# Altium schematic sheet 10_SPI.schdoc.schdoc
size 309 x 223 mm; Symbol: Sheet-Symbol_A4; Device: Sheet-Symbol_A4; @Page Name: SPI; @Create Date: 2023-12-01; @Page Count: 13; @Page No: 13; @Project Name: STM32F722RET6; @Schematic Name: 开发板; @Update Date: 2023-12-01; Company: 嘉立创EDA; Page Size: A4; Version: V1.0
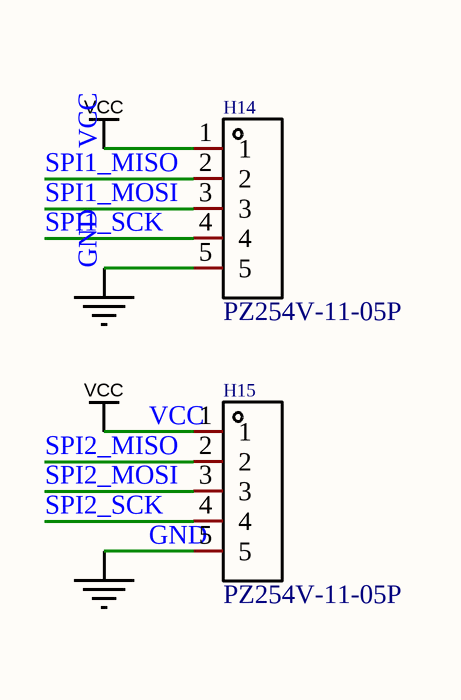
[diagram p0: 10_SPI.schdoc.schdoc]

## Parts
H14  PZ254V-11-05P  [HDR-TH_5P-P2.54-V-M]
H15  PZ254V-11-05P  [HDR-TH_5P-P2.54-V-M]

## Nets
GND: H14.5 H15.5
VCC: H14.1 H15.1
SPI1_MISO: H14.2
SPI1_MOSI: H14.3
SPI1_SCK: H14.4
SPI2_MISO: H15.2
SPI2_MOSI: H15.3
SPI2_SCK: H15.4

## Notes on the sheet
- 1
- 2
- 3
- 4
- 5
- 6
- A
- B
- C
- 原理图
- 开发板
- 创建日期
- 更新日期
- 2023-12-01
- 审阅
- 绘制
- 图页
- SPI
- 物料编码
- STM32F722RET6
- D
- 版本
- 尺寸
- 页
- 13
- 共
- V1.0
- A4
- 嘉立创EDA

## Library data of the parts
H14 H15 = PZ254V-11-05P: 排数:单排;总PIN位数:5P;间距:2.54mm;插针结构:1x5P;行距:-;安装类型:直插;圆针/方针:方针;额定电流:-;额定电压:-;配合针长度:6mm;塑高:2.5mm;端接针长度:3mm;触头材质:黄铜;触头镀层:-;工作温度范围:-40℃~+105℃;颜色:黑色;; Manufacturer: XFCN(兴飞); Add into BOM: yes; Pitch: 2.54mm; Pin Structure: 1x5P; Circluar Pins/Square Pins: 方针; Name: PZ254V-11-05P; Symbol: PZ254V-11-05P; Device: PZ254V-11-05P; LCSC Part Name: 2.54mm 1x5P 直插 方针; Supplier Part: C492404; Manufacturer Part: PZ254V-11-05P; Supplier Footprint: 插件,P=2.54mm; JLCPCB Part Class: Extended Part; Datasheet: https://atta.szlcsc.com/upload/public/pdf/source/20200309/C492404_E51533260F8710EFF5D4617281164C1D.pdf; Supplier: LCSC; Convert to PCB: yes; Number of Rows: 单排; Number of Pins: 5P; Row Spacing: -; Mounting Type: 直插; Current Rating (Max): -; Voltage Rating (Max): -; Length of Mating Pin: 6mm; Insulation Height: 2.5mm; Length of End Connection Pin: 3mm; Contact Material: 黄铜; Contact Plating: -; Operating Temperature Range: -40℃~+105℃; Color: 黑色